# EAGLE design Volt Meter PCB Design (EAGLE 9.6.2)
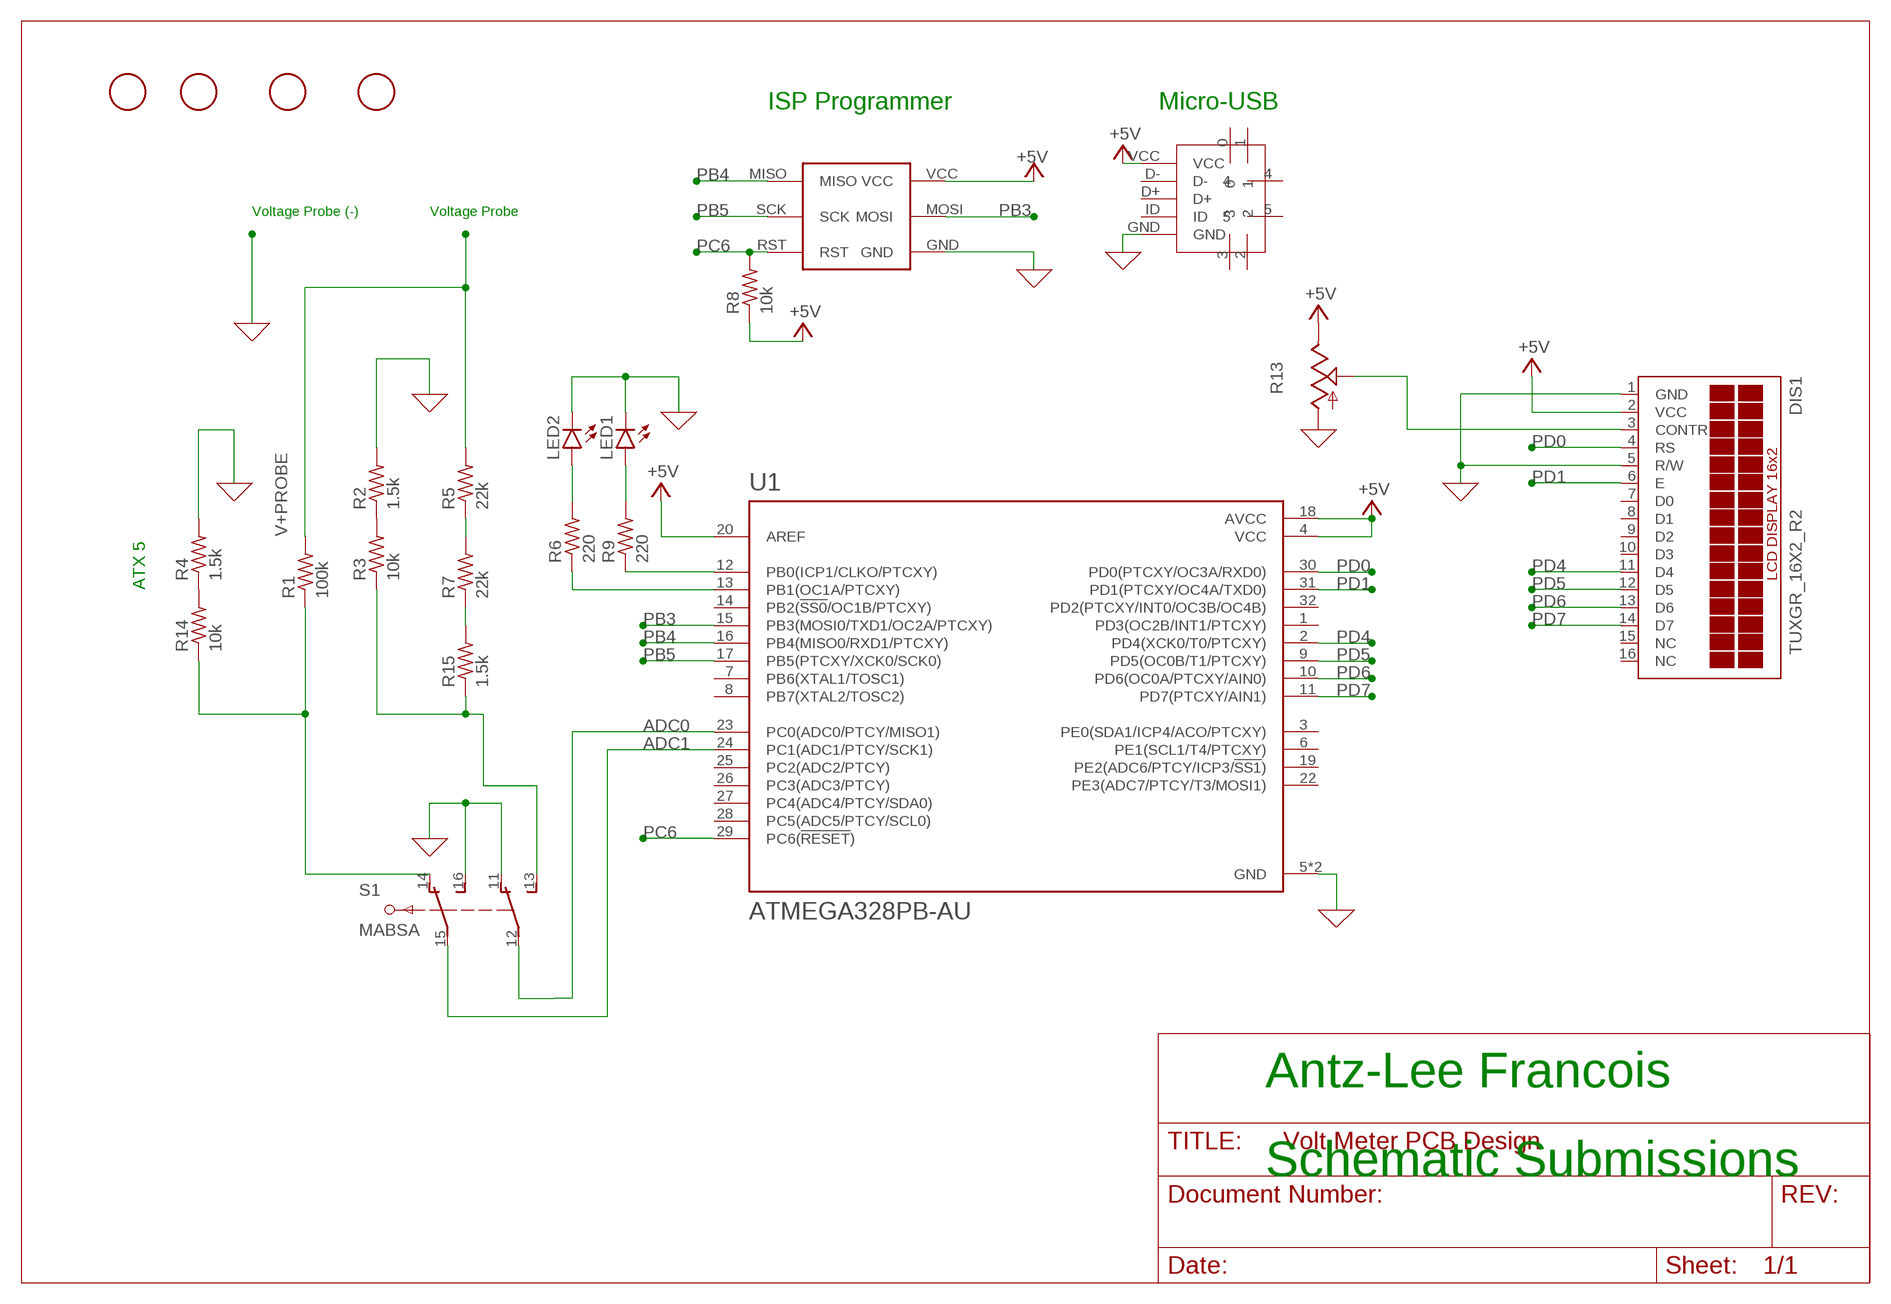
[diagram p0: schematic, sheet 1]

## Parts
AVR-ISP  AVR-ISP  [AVR-ISP]
DIS1  TUXGR_16X2_R2  [TUXGR_16X2_R2]
LED1  LED5MM  [LED5MM]
LED2  LED5MM  [LED5MM]
MICROUSB1  MICROUSB1  [MICROUSB1]
R1  100k  R-US_M0805  [M0805]
R2  1.5k  R-US_M0805  [M0805]
R3  10k  R-US_M0805  [M0805]
R4  1.5k  R-US_M0805  [M0805]
R5  22k  R-US_M0805  [M0805]
R6  220  R-US_M0805  [M0805]
R7  22k  R-US_M0805  [M0805]
R8  10k  R-US_M0805  [M0805]
R9  220  R-US_M0805  [M0805]
R13  TRIM_US-B25P  [B25P]
R14  10k  R-US_M0805  [M0805]
R15  1.5k  R-US_M0805  [M0805]
S1  MABSA  [MABSA]
U1  ATMEGA328PB-AU  [QFP80P900X900X120-32N]
U$1  FIDUCIAL  [FIDUCIAL_1MM]
U$2  FIDUCIAL  [FIDUCIAL_1MM]
U$3  FIDUCIAL  [FIDUCIAL_1MM]
U$4  FIDUCIAL  [FIDUCIAL_1MM]

## Nets
0: AVR-ISP.GND DIS1.1(GND) DIS1.5(R/W) LED1.K(C) LED2.K(C) MICROUSB1.GND R2.2 R4.2 R13.A S1.11 S1.16 U1.5(GND) U1.21(GND) ; supply symbol labelled GND
+5V: AVR-ISP.VCC DIS1.2(VCC) MICROUSB1.VCC R8.1 R13.E U1.4(VCC) U1.18(AVCC) U1.20(AREF)
ADC0: S1.12 U1.23(PC0(ADC0/PTCY/MISO1))
ADC1: S1.15 U1.24(PC1(ADC1/PTCY/SCK1))
ATX5: R1.1 R14.1 S1.14
ATX10: R5.1 R7.2
HLED: LED1.A R9.2
HLED_PWR: R9.1 U1.12(PB0(ICP1/CLKO/PTCXY))
LCD_DIMMER: DIS1.3(CONTR) R13.S
LLED: LED2.A R6.2
LLED_PWR: R6.1 U1.13(PB1(OC1A/PTCXY))
N$4: R4.1 R14.2
N$6: R2.1 R3.2
N$8: R7.1 R15.2
N$11: R3.1 R15.1 S1.13
PB3: AVR-ISP.MOSI U1.15(PB3(MOSI0/TXD1/OC2A/PTCXY))
PB4: AVR-ISP.MISO U1.16(PB4(MISO0/RXD1/PTCXY))
PB5: AVR-ISP.SCK U1.17(PB5(PTCXY/XCK0/SCK0))
PC6: AVR-ISP.RST R8.2 U1.29(PC6(!RESET!))
PD0: DIS1.4(RS) U1.30(PD0(PTCXY/OC3A/RXD0))
PD1: DIS1.6(E) U1.31(PD1(PTCXY/OC4A/TXD0))
PD4: DIS1.11(D4) U1.2(PD4(XCK0/T0/PTCXY))
PD5: DIS1.12(D5) U1.9(PD5(OC0B/T1/PTCXY))
PD6: DIS1.13(D6) U1.10(PD6(OC0A/PTCXY/AIN0))
PD7: DIS1.14(D7) U1.11(PD7(PTCXY/AIN1))
V+PROBE: R1.2 R5.2
Unconnected: DIS1.7(D0) DIS1.8(D1) DIS1.9(D2) DIS1.10(D3) DIS1.15(NC) DIS1.16(NC) MICROUSB1.0 MICROUSB1.1 MICROUSB1.2 MICROUSB1.3 MICROUSB1.4 MICROUSB1.5 MICROUSB1.D+ MICROUSB1.D- MICROUSB1.ID U1.1(PD3(OC2B/INT1/PTCXY)) U1.3(PE0(SDA1/ICP4/ACO/PTCXY)) U1.6(PE1(SCL1/T4/PTCXY)) U1.7(PB6(XTAL1/TOSC1)) U1.8(PB7(XTAL2/TOSC2)) U1.14(PB2(!SS0!/OC1B/PTCXY)) U1.19(PE2(ADC6/PTCY/ICP3/!SS1!)) U1.22(PE3(ADC7/PTCY/T3/MOSI1)) U1.25(PC2(ADC2/PTCY)) U1.26(PC3(ADC3/PTCY)) U1.27(PC4(ADC4/PTCY/SDA0)) U1.28(PC5(ADC5/PTCY/SCL0)) U1.32(PD2(PTCXY/INT0/OC3B/OC4B))

## Notes on the sheet
- ISP Programmer | Micro-USB
- Voltage Probe (-) | Voltage Probe
- ATX 5
- Antz-Lee Francois
- Schematic Submissions

## Library data of the parts
AVR-ISP = AVR-ISP:AVR-ISP: Check prices <https://pricing.snapeda.com/search/part/AVR-ISP/?ref=eda>; AVAILABILITY: Bad; DESCRIPTION: Emulators / Simulators AVR USB IN CIRCUIT EMUL/PRGMR ISP; MF: Gravitech; MP: AVR-ISP; PACKAGE: None; PRICE: None
DIS1 = display-lcd:TUXGR_16X2_R2: Tuxgraphics LCD display 16x2 characters reflective, without background light Source: tuxgr_12x2_r2.pdf; OC_FARNELL: unknown; OC_NEWARK: unknown
LED1 LED2 = led:LED: LED OSRAM: - CHIPLED LG R971, LG N971, LY N971, LG Q971, LY Q971, LO R971, LY R971 LH N974, LH R974 LS Q976, LO Q976, LY Q976 LO Q996 - Hyper CHIPLED LW Q18S LB Q993, LB Q99A, LB R99A - SideLED LS A670, LO A670, LY A670, LG A670, LP A670 LB A673, LV A673, LT A673, LW A673 LH A674 LY A675 LS A676, LA A676, LO A676, LY A676, LW A676 LS A679, LY A679, LG A679 - Hyper Micro SIDELED® LS Y876, LA Y876, LO Y876, LY Y876 LT Y87S - SmartLED LW L88C, LW L88S LB L89C, LB L89S, LG L890 LS L89K, LO L89K, LY L89K LS L896, LA L896, LO L896, LY L896 - TOPLED LS T670, LO T670, LY T670, LG T670, LP T670 LSG T670, LSP T670, LSY T670, LOP T670, LYG T670 LG T671, LOG T671, LSG T671 LB T673, LV T673, LT T673, LW T673 LH T674 LS T676, LA T676, LO T676, LY T676, LB T676, LH T676, LSB T676, LW T676 LB T67C, LV T67C, LT T67C, LS T67K, LO T67K, LY T67K, LW E67C LS E67B, LA E67B, LO E67B, LY E67B, LB E67C, LV E67C, LT E67C LW T67C LS T679, LY T679, LG T679 LS T770, LO T770, LY T770, LG T770, LP T770 LB T773, LV T773, LT T773, LW T773 LH T774 LS E675, LA E675, LY E675, LS T675 LS T776, LA T776, LO T776, LY T776, LB T776 LHGB T686 LT T68C, LB T68C - Hyper Mini TOPLED® LB M676 - Mini TOPLED Santana® LG M470 LS M47K, LO M47K, LY M47K Source: http://www.osram.convergy.de LUXEON: - LUMILED® LXK2-PW12-R00, LXK2-PW12-S00, LXK2-PW14-U00, LXK2-PW14-V00 LXK2-PM12-R00, LXK2-PM12-S00, LXK2-PM14-U00 LXK2-PE12-Q00, LXK2-PE12-R00, LXK2-PE12-S00, LXK2-PE14-T00, LXK2-PE14-U00 LXK2-PB12-K00, LXK2-PB12-L00, LXK2-PB12-M00, LXK2-PB14-N00, LXK2-PB14-P00, LXK2-PB14-Q00 LXK2-PR12-L00, LXK2-PR12-M00, LXK2-PR14-Q00, LXK2-PR14-R00 LXK2-PD12-Q00, LXK2-PD12-R00, LXK2-PD12-S00 LXK2-PH12-R00, LXK2-PH12-S00 LXK2-PL12-P00, LXK2-PL12-Q00, LXK2-PL12-R00 Source: www.luxeon.com KINGBRIGHT: KA-3528ASYC Source: www.kingbright.com
MICROUSB1 = MICROUSB1:MICROUSB1
R1-R9 R14 R15 = rcl:R-US_: RESISTOR, American symbol; SPICEPREFIX: R
R13 = pot:TRIM_US-: POTENTIOMETER
S1 = con-hirschmann:MABSA: Dual SWITCH; OC_FARNELL: unknown; OC_NEWARK: unknown
U1 = ATMEGA328PB-AU:ATMEGA328PB-AU: ATmega Series 20 MHz 32 KB Flash 2 KB SRAM 8-Bit Microcontroller - TQFP-32; DESCRIPTION: AVR AVR® ATmega Microcontroller IC 8-Bit 20MHz 32KB (16K x 16) FLASH 32-TQFP (7x7); DIGI-KEY_PART_NUMBER: ATMEGA328PB-AURTR-ND; MF: Microchip Technology; MP: ATMEGA328PB-AU; PACKAGE: TQFP-32 Microchip Technology; PURCHASE-URL: https://pricing.snapeda.com/search/part/ATMEGA328PB-AU/?ref=eda
U$1-U$4 = ECE388:FIDUCIAL: For use by pick and place machines to calibrate the vision/machine, 1mm By microbuilder.eu

## Board
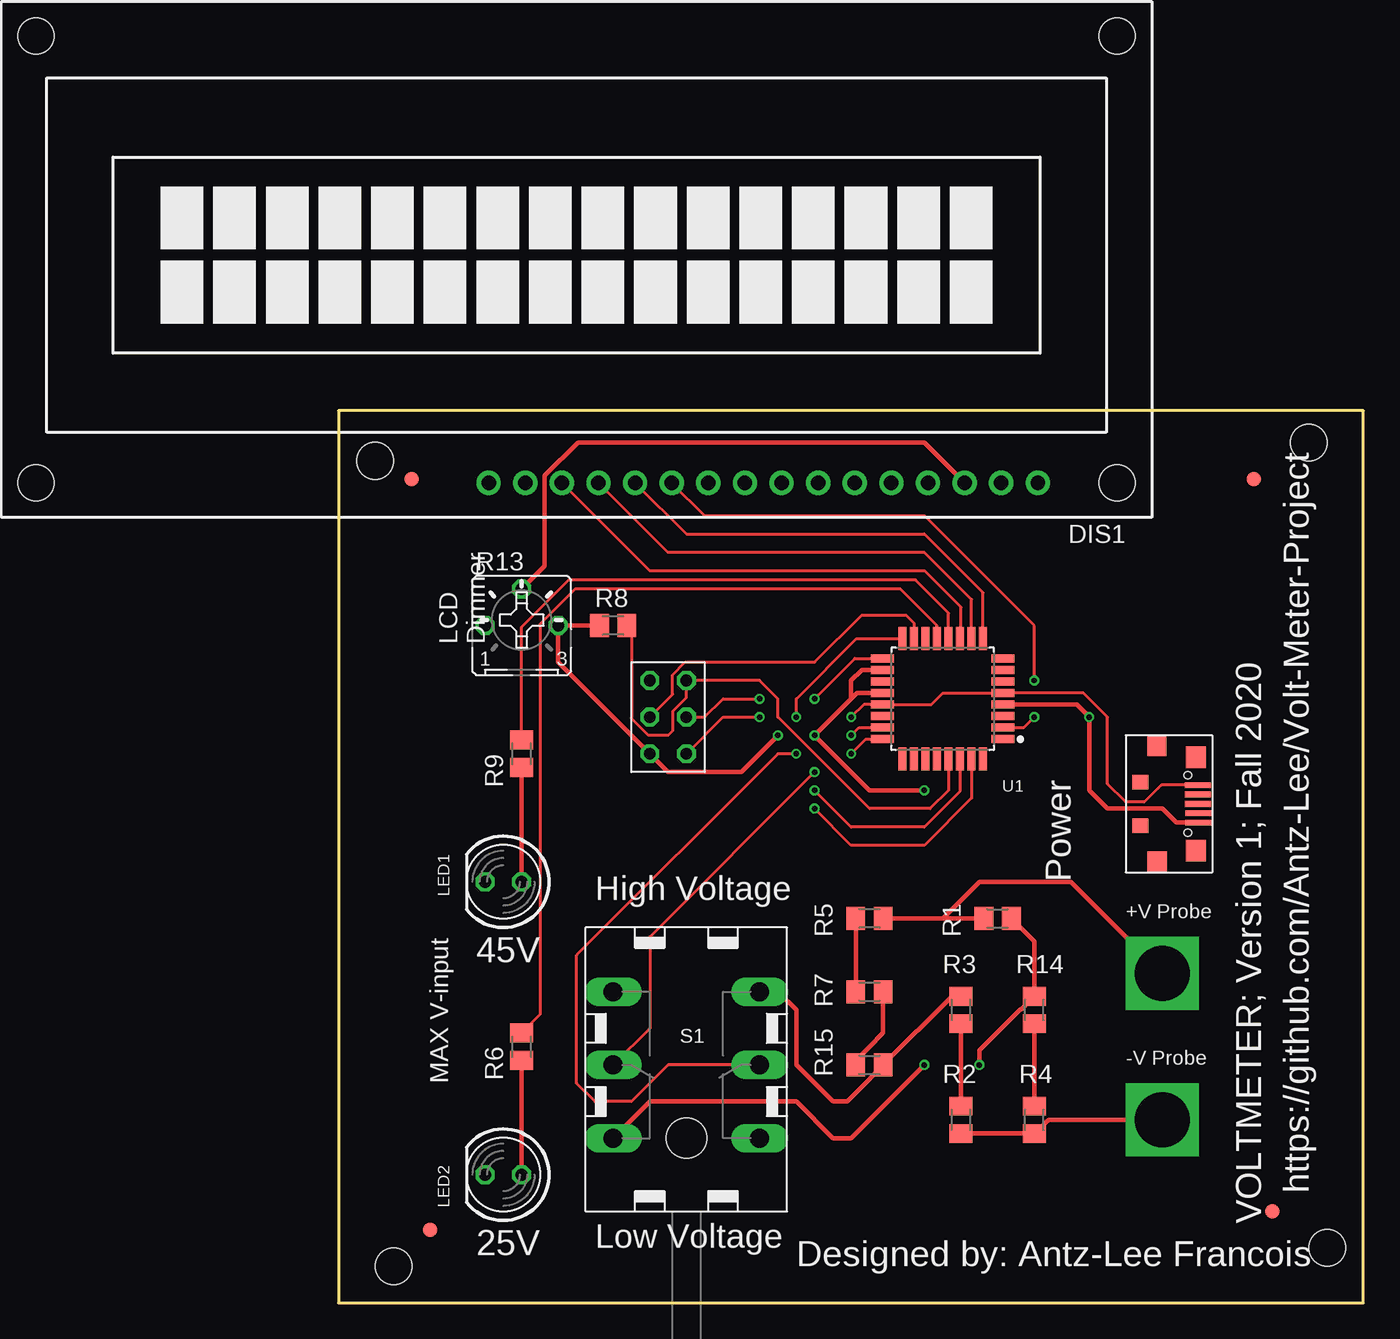
[diagram p1: board, top side]
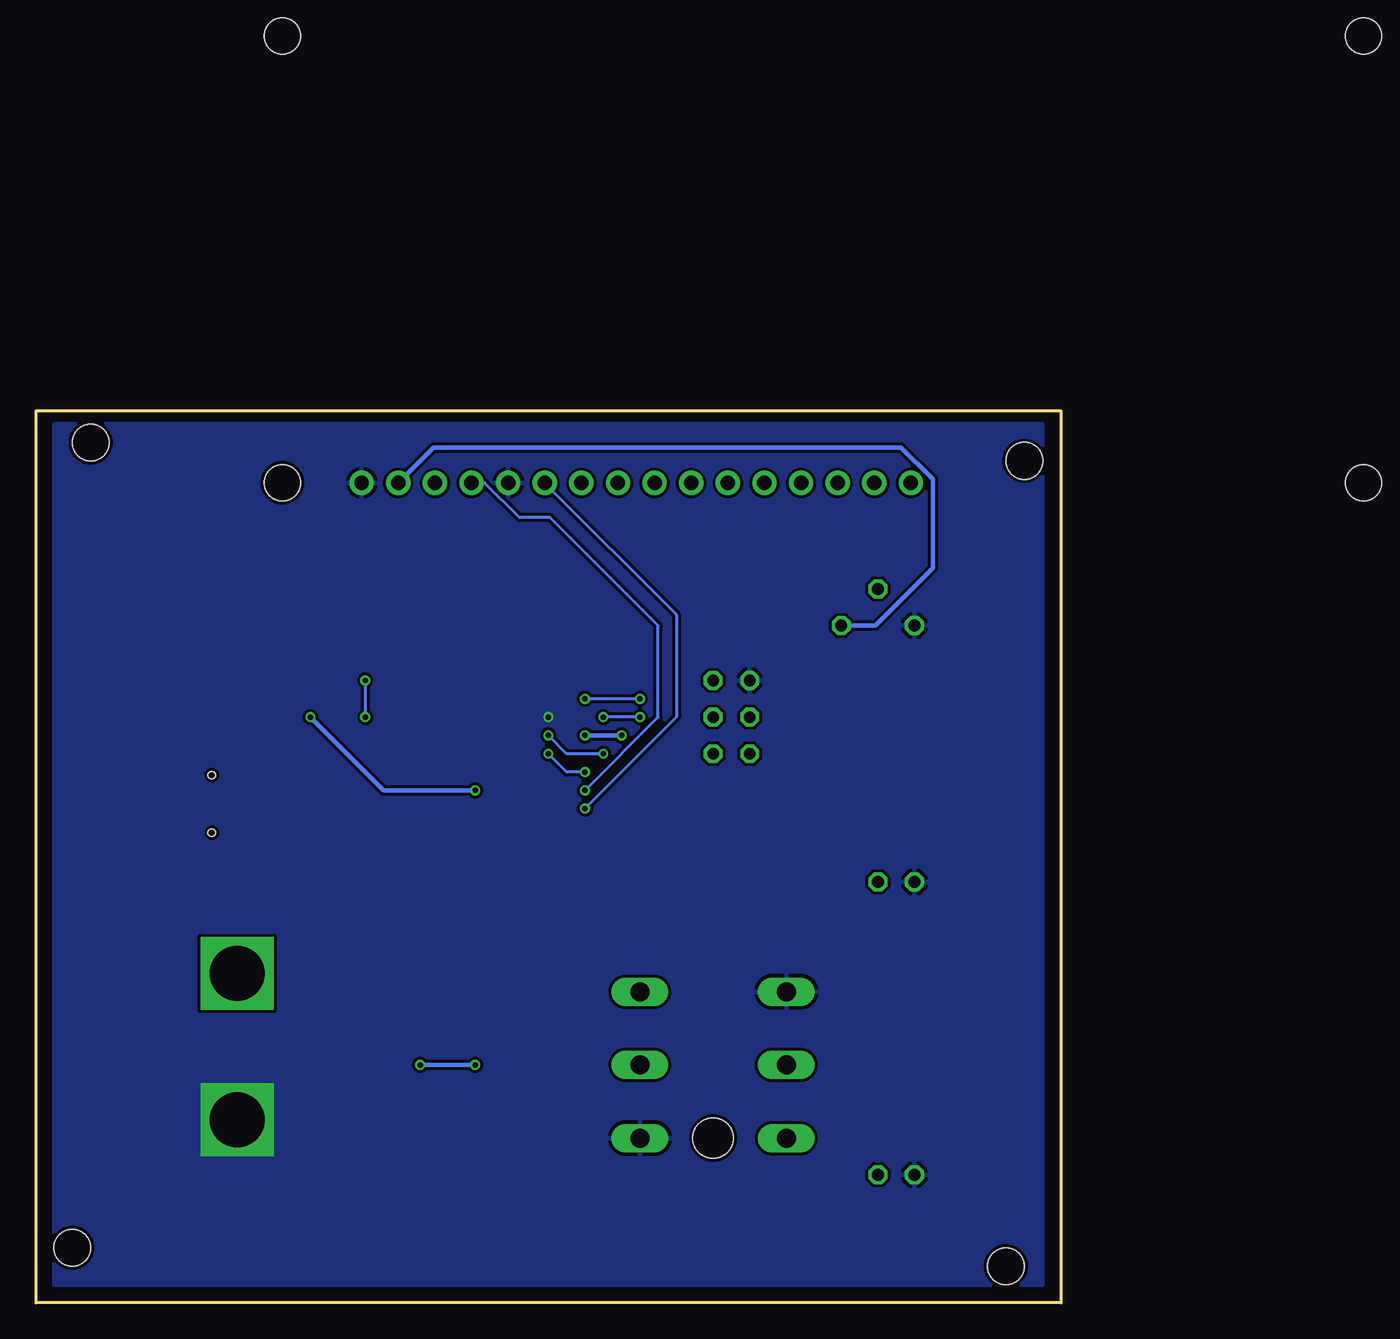
[diagram p2: board, bottom side, seen from below]

Size 71.1 x 61.9 mm. Coordinates in mm from the lower left corner, seen from the top.
Outline: 0,0 71.1,0 71.1,61.9 0,61.9 0,0
Copper layers (1*16): Top 0.035mm / dielectric 1.5mm / Bottom 0.035mm
Design rules "Dirty8TS": minimum track width 8mil, minimum drill 15mil, track to track 8mil, track to pad 8mil, pad to pad 8mil, via to via 8mil, smd to smd 0mil, copper to edge 10mil, drill to drill 10mil, minimum pad ring 10mil, minimum via ring 6mil, stop-mask expansion 2mil, vias tented up to drill 25mil, thermal gap 10mil
Holes 2.54 mm at 2.54,58.42 3.81,2.54 68.58,3.81 67.31,59.69

### Footprints (pad centres in the part's own frame; a part is rotated, then mirrored left to right if it is on the bottom)
AVR-ISP = drill 0.8 octagon: GND 2.54,1.27; MISO -2.54,-1.27; MOSI 0,1.27; RST 2.54,-1.27; SCK 0,-1.27; VCC -2.54,1.27
TUXGR_16X2_R2 = drill 1 pad 1.676: 1 -32,15.5; 2 -29.46,15.5; 3 -26.92,15.5; 4 -24.38,15.5; 5 -21.84,15.5; 6 -19.3,15.5; 7 -16.76,15.5; 8 -14.22,15.5; 9 -11.68,15.5; 10 -9.14,15.5; 11 -6.6,15.5; 12 -4.06,15.5; 13 -1.52,15.5; 14 1.02,15.5; 15 3.56,15.5; 16 6.1,15.5 | hole 2.5: -37.5,-15.5; 37.5,-15.5; -37.5,15.5; 37.5,15.5
LED5MM = drill 0.813 octagon: A -1.27,0; K 1.27,0
MICROUSB1 = smd 1.5 x 1.4: 0 8,4.85; 3 1.5,4.85 | smd 1.5 x 1.35: 1 8.815,2.16; 2 0.67,2.155 | smd 1 x 1.1: 4 6.25,1; 5 3.25,1 | smd 0.4 x 1.8: D+ 4.75,5; D- 5.4,5.02; GND 3.45,5; ID 4.1,5; VCC 6.05,5.02 | hole 0.5: 2.75,4.3; 6.75,4.3
M0805 = smd 1.3 x 1.6: 1 -0.95,0; 2 0.95,0
B25P = drill 0.813 octagon: A -2.54,0; E 2.54,0; S 0,2.54
MABSA = drill 1.321 long: 11 5.08,-5.08; 12 5.08,0; 13 5.08,5.08; 14 -5.08,-5.08; 15 -5.08,0; 16 -5.08,5.08 | hole 2.794: 0,-5.08
QFP80P900X900X120-32N = smd 1.6 x 0.55: 1 -4.18,2.8; 2 -4.18,2; 3 -4.18,1.2; 4 -4.18,0.4; 5 -4.18,-0.4; 6 -4.18,-1.2; 7 -4.18,-2; 8 -4.18,-2.8; 17 4.18,-2.8; 18 4.18,-2; 19 4.18,-1.2; 20 4.18,-0.4; 21 4.18,0.4; 22 4.18,1.2; 23 4.18,2; 24 4.18,2.8 | smd 0.55 x 1.6: 9 -2.8,-4.18; 10 -2,-4.18; 11 -1.2,-4.18; 12 -0.4,-4.18; 13 0.4,-4.18; 14 1.2,-4.18; 15 2,-4.18; 16 2.8,-4.18; 25 2.8,4.18; 26 2,4.18; 27 1.2,4.18; 28 0.4,4.18; 29 -0.4,4.18; 30 -1.2,4.18; 31 -2,4.18; 32 -2.8,4.18
FIDUCIAL_1MM = smd 1 x 1: 1 0,0

### Placement (x,y rotation side)
AVR-ISP  22.86,40.64 90 top
DIS1  16.51,72.39 180 top
LED1  11.43,29.21 180 top
LED2  11.43,8.89 180 top
MICROUSB1  54.61,39.37 270 top
R1  45.72,26.67 180 top
R2  43.18,12.7 270 top
R3  43.18,20.32 270 top
R4  48.26,12.7 270 top
R5  36.83,26.67 0 top
R6  12.7,17.78 270 top
R7  36.83,21.59 180 top
R8  19.05,46.99 0 top
R9  12.7,38.1 270 top
R13  12.7,46.99 0 top
R14  48.26,20.32 270 top
R15  36.83,16.51 180 top
S1  24.13,16.51 0 top
U1  41.91,41.91 180 top
U$1  5.08,57.15 0 top
U$2  6.35,5.08 0 top
U$3  64.77,6.35 0 top
U$4  63.5,57.15 0 top

### Tracks (layer width: path | path; a pad name or v marks a point on that pad's centre or on a via)
0  (via drill 0.38, 3.81 pad 5.08)
  Top 0.203: v35.56,40.64 36.43,41.51 U1.21 41.11,41.51 41.91,42.31 U1.5 51.67,42.31 53.34,40.64 53.34,36.02 54.61,34.75 55.9,34.75 57.07,35.92 MICROUSB1.GND
  Top 0.305: R2.2 R4.2 49.15,12.64 49.21,12.64 49.26,12.7 v57.15,12.7
  pour Bottom: 1.27,60.96 1.27,1.27 69.85,1.27 69.85,60.96
+5V  (via drill 0.38)
  Top 0.305: U1.20 35.96,42.31 35.56,41.91 | 35.56,41.91 v33.02,39.37 36.83,35.56 v40.64,35.56 | v30.48,39.37 27.94,36.83 22.86,36.83 AVR-ISP.VCC 15.24,44.45 R13.E R8.1 | U1.18 36.29,43.91 35.56,43.18 35.56,41.91 | U1.4 51.2,41.51 v52.07,40.64 52.07,35.56 53.34,34.29 57.15,34.29 58.12,33.32 MICROUSB1.VCC
  Bottom 0.305: v33.02,39.37 v30.48,39.37 | v40.64,35.56 46.99,35.56 v52.07,40.64 | DIS1.2 43.51,59.35 11.09,59.35 8.89,57.15 8.89,50.97 12.87,46.99 R13.E
ADC0  (via drill 0.38)
  Top 0.203: v35.56,39.37 36.1,39.91 U1.23 | v31.75,38.1 30.48,38.1 16.51,24.13 16.51,15.24 17.78,13.97 20.32,13.97 22.86,16.51 S1.12
  Bottom 0.203: v35.56,39.37 34.29,38.1 v31.75,38.1
ADC1  (via drill 0.38)
  Top 0.203: v35.56,38.1 36.57,39.11 U1.24 | v33.02,36.83 21.59,25.4 21.59,19.05 S1.15
  Bottom 0.203: v33.02,36.83 34.29,36.83 v35.56,38.1
ATX5  (via drill 0.38)
  Top 0.305: R1.1 48.26,25.08 R14.1 47.37,20.38 47.31,20.38 44.45,17.51 v44.45,16.51 | S1.14 21.59,13.97 31.75,13.97 34.29,11.43 35.56,11.43 v40.64,16.51
  Bottom 0.305: v40.64,16.51 v44.45,16.51
ATX10
  Top 0.305: R5.1 R7.2
HLED
  Top 0.305: R9.2 LED1.A
HLED_PWR
  Top 0.203: U1.12 42.31,47.86 40.02,50.15 15.96,50.15 12.7,46.89 R9.1
LCD_DIMMER
  Top 0.305: R13.S 14.3,51.13 14.3,57.38 16.6,59.69 40.64,59.69 DIS1.3
LLED
  Top 0.305: R6.2 LED2.A
LLED_PWR
  Top 0.203: U1.13 41.51,46.99 38.97,49.53 16.41,49.53 13.97,47.09 13.97,20 R6.1
N$4
  Top 0.305: R4.1 R14.2
N$6
  Top 0.305: R2.1 R3.2
N$8
  Top 0.305: R7.1 37.78,18.73 36.83,17.78 35.88,16.83 | 35.88,16.83 35.56,16.51 | R15.2 35.88,16.83
N$11
  Top 0.305: R3.1 42.54,21.27 R15.1 36.89,15.62 36.89,15.56 35.29,13.97 34.29,13.97 31.75,16.51 31.75,20.32 30.48,21.59 S1.13
PB3
  Top 0.203: U1.15 39.91,47.18 39.37,47.72 36.29,47.72 33.02,44.45 24.04,44.45 23.17,43.58 23.17,42.22 AVR-ISP.MOSI
PB4  (via drill 0.38)
  Top 0.203: AVR-ISP.MISO 26.67,40.64 v29.21,40.64 | v31.75,40.64 31.75,41.91 35.93,46.09 U1.16
  Bottom 0.203: v29.21,40.64 v31.75,40.64
PB5  (via drill 0.38)
  Top 0.203: AVR-ISP.SCK 25.4,40.64 26.67,41.91 v29.21,41.91 | v33.02,41.91 35.82,44.71 U1.17
  Bottom 0.203: v29.21,41.91 v33.02,41.91
PC6
  Top 0.203: U1.29 42.31,35.56 41.04,34.29 36.83,34.29 30.48,40.64 30.48,41.91 29.21,43.18 AVR-ISP.RST 24.13,42 23.17,41.04 23.17,39.68 22.86,39.37 21.5,39.37 20.32,40.55 20.32,46.67 R8.2
PD0  (via drill 0.38)
  Top 0.203: U1.30 43.11,35.49 40.64,33.02 35.56,33.02 v33.02,35.56
  Bottom 0.203: v33.02,35.56 27.94,40.64 27.94,46.99 35.43,54.48 37.55,54.48 39.97,56.89 DIS1.4
PD1  (via drill 0.38)
  Top 0.203: U1.31 43.91,35.02 40.64,31.75 35.56,31.75 v33.02,34.29
  Bottom 0.203: v33.02,34.29 26.67,40.64 26.67,47.75 DIS1.6
PD4  (via drill 0.38)
  Top 0.203: U1.2 47.53,39.91 v48.26,40.64 | v48.26,43.18 48.26,46.99 40.64,54.61 25.39,54.61 DIS1.11
  Bottom 0.203: v48.26,43.18 v48.26,40.64
PD5
  Top 0.203: U1.9 44.71,49.27 40.64,53.34 24.12,53.34 DIS1.12
PD6
  Top 0.203: U1.10 43.91,48.8 40.64,52.07 22.85,52.07 DIS1.13
PD7
  Top 0.203: U1.11 43.18,46.16 43.18,48.26 40.64,50.8 21.58,50.8 DIS1.14
V+PROBE  (via drill 3.81 pad 5.08)
  Top 0.305: R1.2 41.91,26.67 | 41.91,26.67 R5.2 | 41.91,26.67 44.45,29.21 49.53,29.21 50.8,29.21 v57.15,22.86

### Text on the board
tPlace: LCD / Dimmer | VOLTMETER; Version 1; Fall 2020 | Power | High Voltage | +V Probe | 45V | -V Probe | MAX V-input | https://github.com/Antz-Lee/Volt-Meter-Project | 25V | Low Voltage | Designed by: Antz-Lee Francois